# EAGLE design pir_bigger_with cap (EAGLE 8.3.1)
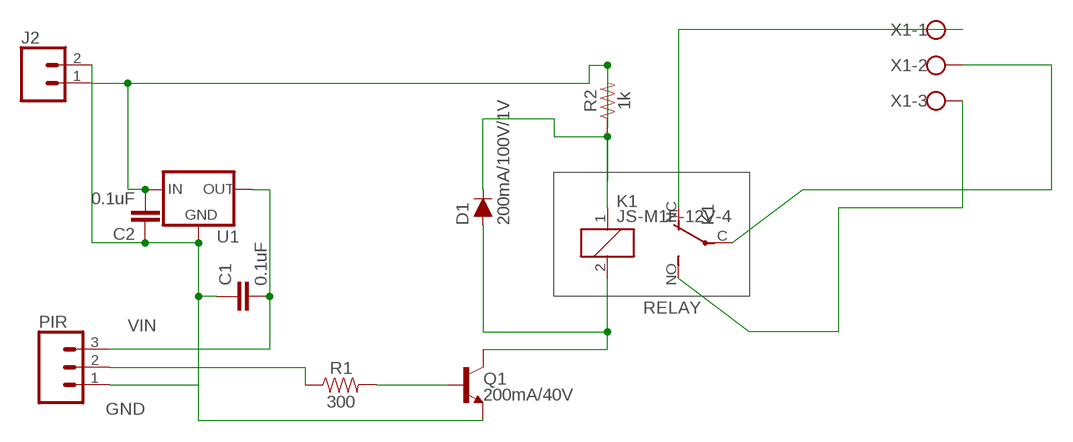
[diagram p0: schematic, sheet 1]

## Parts
C1  0.1uF  0.1UF-KIT-EZ-50V-20%  [CAP-PTH-SMALL-KIT]
C2  0.1uF  0.1UF-KIT-EZ-50V-20%  [CAP-PTH-SMALL-KIT]
D1  200mA/100V/1V  DIODE-1N4148  [DIODE-1N4148]
J2  CONN_025MM  [SCREWTERMINAL-5MM-2]
K1  JS-M1F-12V-4  [JS-M]
PIR  CONN_03LONGPADS  [1X03_LONGPADS]
Q1  200mA/40V  TRANS_NPN-2N3904  [TO-92]
R1  300  10KOHM-HORIZ-1/4W-5%  [AXIAL-0.3]
R2  1k  10KOHM-HORIZ-1/4W-5%  [AXIAL-0.3]
U1  V_REG_78XXSINK  [TO220-IGO]
X1  W237-103  [W237-103]

## Nets
GND: C1.1 C2.1 J2.2 PIR.1 Q1.1(E) U1.GND
N$1: C2.2 J2.1 R2.P$2 U1.IN
N$2: K1.C(2:P) X1.2
N$3: PIR.2 R1.P$1
N$4: Q1.2(B) R1.P$2
N$5: D1.A K1.2 Q1.3(C)
N$8: K1.NC(2:O) X1.1
N$9: K1.NO(2:S) X1.3
N$10: D1.C K1.1 R2.P$1
VIN: C1.2 PIR.3 U1.OUT

## Notes on the sheet
- RELAY

## Library data of the parts
C1 C2 = SparkFun-Capacitors:0.1UF: 0.1µF ceramic capacitors A capacitor is a passive two-terminal electrical component used to store electrical energy temporarily in an electric field.; PROD_ID: CAP-08370
D1 = SparkFun-DiscreteSemi:DIODE: Diode These are standard reverse protection diodes and small signal diodes. SparkFun Products: SparkFun SparkPunk Sound Kit <https://www.sparkfun.com/products/11177> SparkFun ESP8266 Thing <https://www.sparkfun.com/products/13231>; PROD_ID: DIO-08378
J2 = SparkFun-Connectors:CONN_02: Multi connection point. Often used as Generic Header-pin footprint for 0.1 inch spaced/style header connections On any of the 0.1 inch spaced packages, you can populate with these: Break Away Headers - Straight <https://www.sparkfun.com/products/116> (PRT-00116) Break Away Male Headers - Right Angle <https://www.sparkfun.com/products/553> (PRT-00553) Female Headers <https://www.sparkfun.com/products/115> (PRT-00115) Break Away Headers - Machine Pin <https://www.sparkfun.com/products/117> (PRT-00117) Break Away Female Headers - Swiss Machine Pin <https://www.sparkfun.com/products/743> (PRT-00743) For SCREWTERMINALS and SPRING TERMINALS visit here: Screw Terimnals on SparkFun.com <https://www.sparkfun.com/search/results?term=Screw+Terminals> (5mm/3.5mm/2.54mm spacing) This device is also useful as a general connection point to wire up your design to another part of your project. Our various solder wires solder well into these plated through hole pads. Hook-Up Wire - Assortment (Stranded, 22 AWG) <https://www.sparkfun.com/products/11375> (PRT-11375) Hook-Up Wire - Assortment (Solid Core, 22 AWG) <https://www.sparkfun.com/products/11367> (PRT-11367) View the entire wire category on our website here <https://www.sparkfun.com/categories/141> Special notes: Molex polarized connector foot print use with: PRT-08233 with associated crimp pins and housings. 2.54_SCREWTERM for use with PRT-10571. 3.5mm Screw Terminal footprints for PRT-08084 5mm Screw Terminal footprints for use with PRT-08432; SF_SKU: PRT-08432
K1 = relay:JS-M1*: Automotive Ultra-Miniature Power Relay NAiS Source: http://www.mew-europe.com/.. en_ds_61211_0000.pdf; OC_FARNELL: unknown; OC_NEWARK: unknown
PIR = SparkFun-Connectors:CONN_03: Multi connection point. Often used as Generic Header-pin footprint for 0.1 inch spaced/style header connections On any of the 0.1 inch spaced packages, you can populate with these: Break Away Headers - Straight <https://www.sparkfun.com/products/116> (PRT-00116) Break Away Male Headers - Right Angle <https://www.sparkfun.com/products/553> (PRT-00553) Female Headers <https://www.sparkfun.com/products/115> (PRT-00115) Break Away Headers - Machine Pin <https://www.sparkfun.com/products/117> (PRT-00117) Break Away Female Headers - Swiss Machine Pin <https://www.sparkfun.com/products/743> (PRT-00743) Stackable Header - 3 Pin (Female, 0.1") <https://www.sparkfun.com/products/13875> (PRT-13875) For SCREWTERMINALS and SPRING TERMINALS visit here: Screw Terimnals on SparkFun.com <https://www.sparkfun.com/search/results?term=Screw+Terminals> (5mm/3.5mm/2.54mm spacing) This device is also useful as a general connection point to wire up your design to another part of your project. Our various solder wires solder well into these plated through hole pads. Hook-Up Wire - Assortment (Stranded, 22 AWG) <https://www.sparkfun.com/products/11375> (PRT-11375) Hook-Up Wire - Assortment (Solid Core, 22 AWG) <https://www.sparkfun.com/products/11367> (PRT-11367) View the entire wire category on our website here <https://www.sparkfun.com/categories/141> Special notes: Molex polarized connector foot print use with SKU : PRT-08232 with associated crimp pins and housings.
Q1 = SparkFun-DiscreteSemi:TRANS_NPN: NPN transistor Current controlled devices typically used to amplify current or used as a switch. BC547 - COM-08928 <http://www.sparkfun.com/products/8928> (TO-92 45V 100mA) (1.Collector 2.Base 3.Emitter) 2N3904 - COM-00521 <http://www.sparkfun.com/products/521> (TO-92 40V 200mA) (1.Emitter 2.Base 3.Collector) P2N2222A - COM-12852 <http://www.sparkfun.com/products/12852> (TO-92 40V 600mA) (1.Collector 2.Base 3.Emitter); PROD_ID: TRANS-08447
R1 R2 = SparkFun-Resistors:10KOHM: 10kΩ resistor A resistor is a passive two-terminal electrical component that implements electrical resistance as a circuit element. Resistors act to reduce current flow, and, at the same time, act to lower voltage levels within circuits. - Wikipedia; PROD_ID: RES-09435; VALUE: 10k
U1 = SparkFun-IC-Power:V_REG_78XX: Voltage Regulator Standard 78xx regulator. IGO (Input Ground Output). Spark Fun Electronics SKU : COM-00107
X1 = con-wago-500:W237-103: WAGO SCREW CLAMP; MPN: 237-103; OC_FARNELL: unknown; OC_NEWARK: 18M7116

## Board
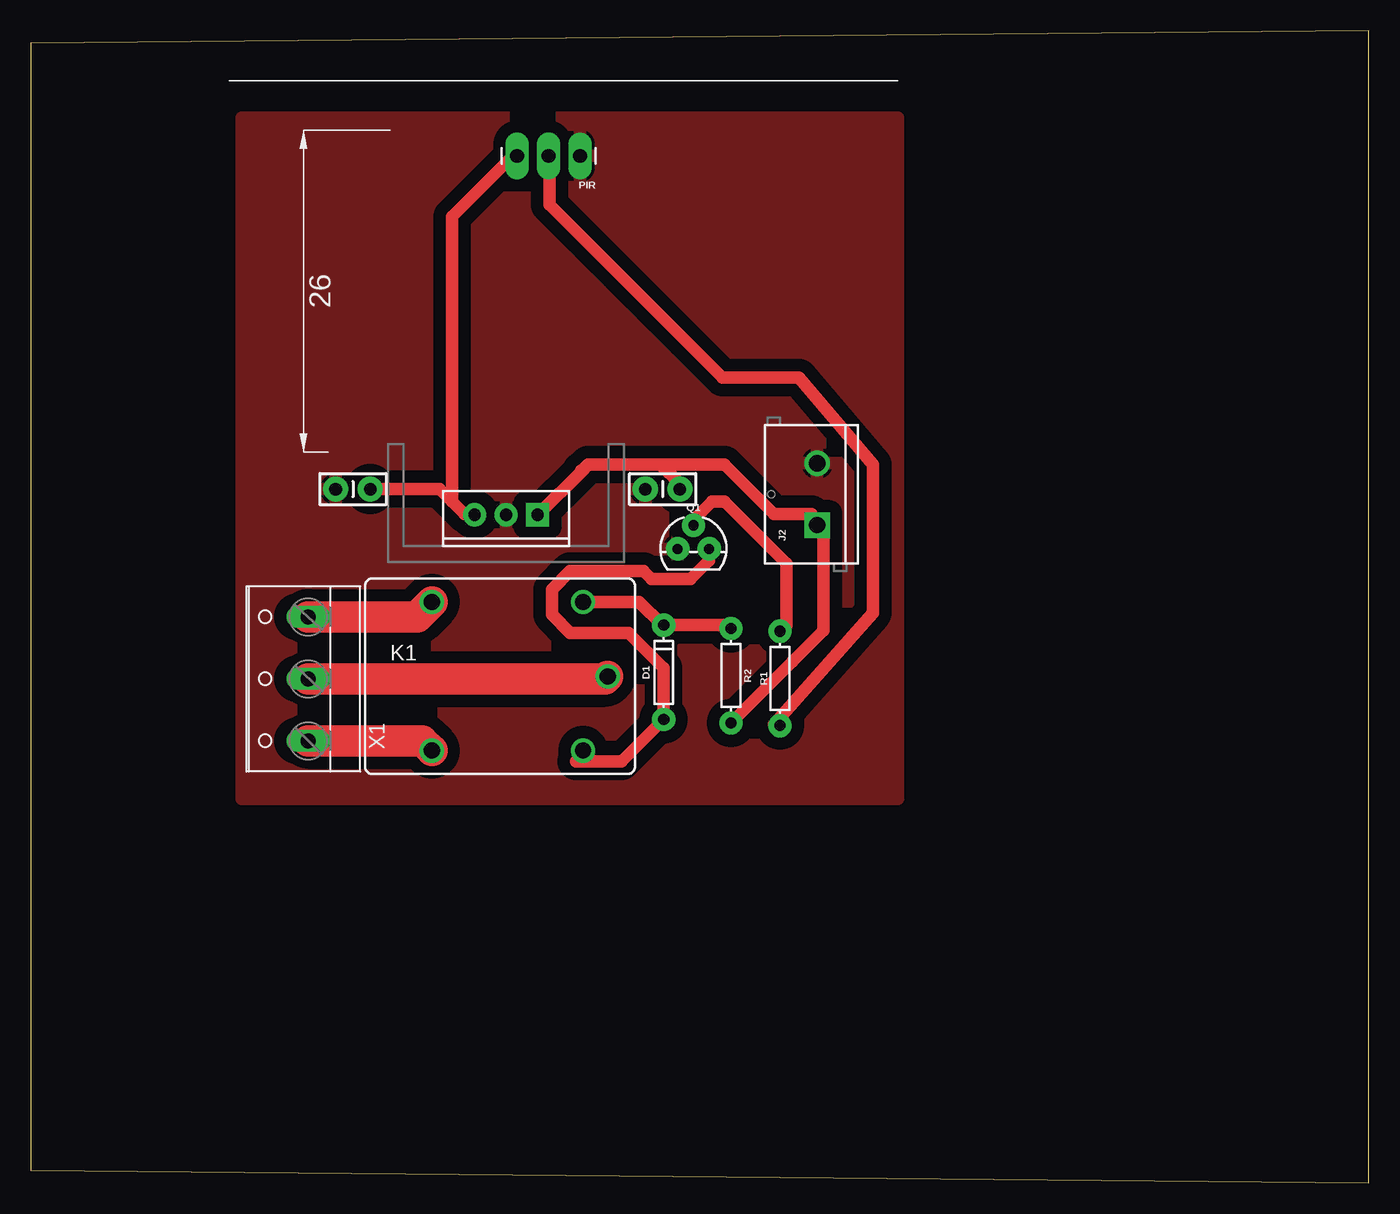
[diagram p1: board, top side]

Size 108 x 93 mm. Coordinates in mm from the lower left corner, seen from the top.
Outline: 0,1 108,0 108,93 0,92 0,1
Copper layers (1*16): Top 0.035mm / dielectric 1.5mm / Bottom 0.035mm
Design rules "default *": minimum track width 6mil, minimum drill 0.35mm, track to track 1mm, track to pad 0.7mm, pad to pad 1mm, via to via 6mil, smd to smd 6mil, copper to edge 40mil, drill to drill 6mil, minimum pad ring 10mil, minimum via ring 8mil, stop-mask expansion 4mil, vias tented up to drill 0mil, thermal gap 10mil

### Footprints (pad centres in the part's own frame; a part is rotated, then mirrored left to right if it is on the bottom)
CAP-PTH-SMALL-KIT = drill 1.016 pad 2.032: 1 -1.397,0; 2 1.397,0
DIODE-1N4148 = drill 0.9 pad 1.88: A -3.81,0; C 3.81,0
SCREWTERMINAL-5MM-2 = drill 1.3 pad 2.032 square: 1 0,0 | drill 1.3 pad 2.032: 2 5,0
JS-M = drill 1.3: 1 6.7,6; 2 6.7,-6; C 8.7,0; NC -5.5,-6; NO -5.5,6
1X03_LONGPADS = drill 1.118 pad 1.88 long: 1 0,0; 2 2.54,0; 3 5.08,0
TO-92 = drill 0.813 pad 1.88: 1 -1.27,0; 2 0,1.905; 3 1.27,0
AXIAL-0.3 = drill 0.9 pad 1.88: P$1 -3.81,0; P$2 3.81,0
TO220-IGO = drill 1 pad 1.88: GND 0,0; OUT 2.54,0 | drill 1 pad 1.88 square: IN -2.54,0
W237-103 = drill 1.194 long: 1 -5,-1.29; 2 0,-1.29; 3 5,-1.29

### Placement (x,y rotation side)
C1  26,56 0 top
C2  51,56 0 top
D1  51.09,41.21 90 top
J2  63.48,53.09 90 top
K1  37.87,40.89 0 top
PIR  44.33,82.91 180 top
Q1  53.49,51.18 0 top
R1  60.47,40.72 90 top
R2  56.53,40.94 270 top
U1  38.36,53.94 180 top
X1  21.1,40.68 90 top

### Tracks (layer width: path | path; a pad name or v marks a point on that pad's centre or on a via)
GND
  pour Top: 17,31 17,86 70,86 70,31
N$1
  Top 1.016: R2.P$2 61.48,42.08 64,44.6 64,53 63.91,53.09 J2.1 63,54 60,54 56,58 50.83,58 | 50.83,58 45,58 44.44,57.44 | 44.44,57.44 41,54 U1.IN | 44.4,57.49 44.44,57.44 | C2.2 52.4,56.43 50.83,58
N$2
  Top 2.54: X1.2 46.36,40.68 K1.C
N$3
  Top 1.016: R1.P$1 60,37 68,46 68,58 62,65 55.84,65 41.88,78.96 41.88,80.82 PIR.2
N$4
  Top 1.016: R1.P$2 61,45 61,50 56,55 55,55 53.49,53.49 Q1.2
N$5
  Top 1.016: K1.2 44.57,34.57 44,34 47.69,34 D1.A 51.09,41.56 48.24,44.41 43.54,44.41 42.09,45.86 42.09,47.92 43.54,49.37 49.48,49.37 50.12,48.73 53.23,48.73 54.76,50.26 Q1.3
N$8
  Top 2.54: X1.1 31.58,35.68 K1.NC
N$9
  Top 2.54: X1.3 31.16,45.68 K1.NO
N$10
  Top 1.016: K1.1 49.11,46.89 50.98,45.02 D1.C 56.26,45.02 R2.P$1
VIN
  Top 1.016: 35,54 34,55 34,78 38.91,82.91 PIR.3 | 35,54 U1.OUT | C1.2 33,56 35,54